# Altium project ControlBoard.PrjPCB
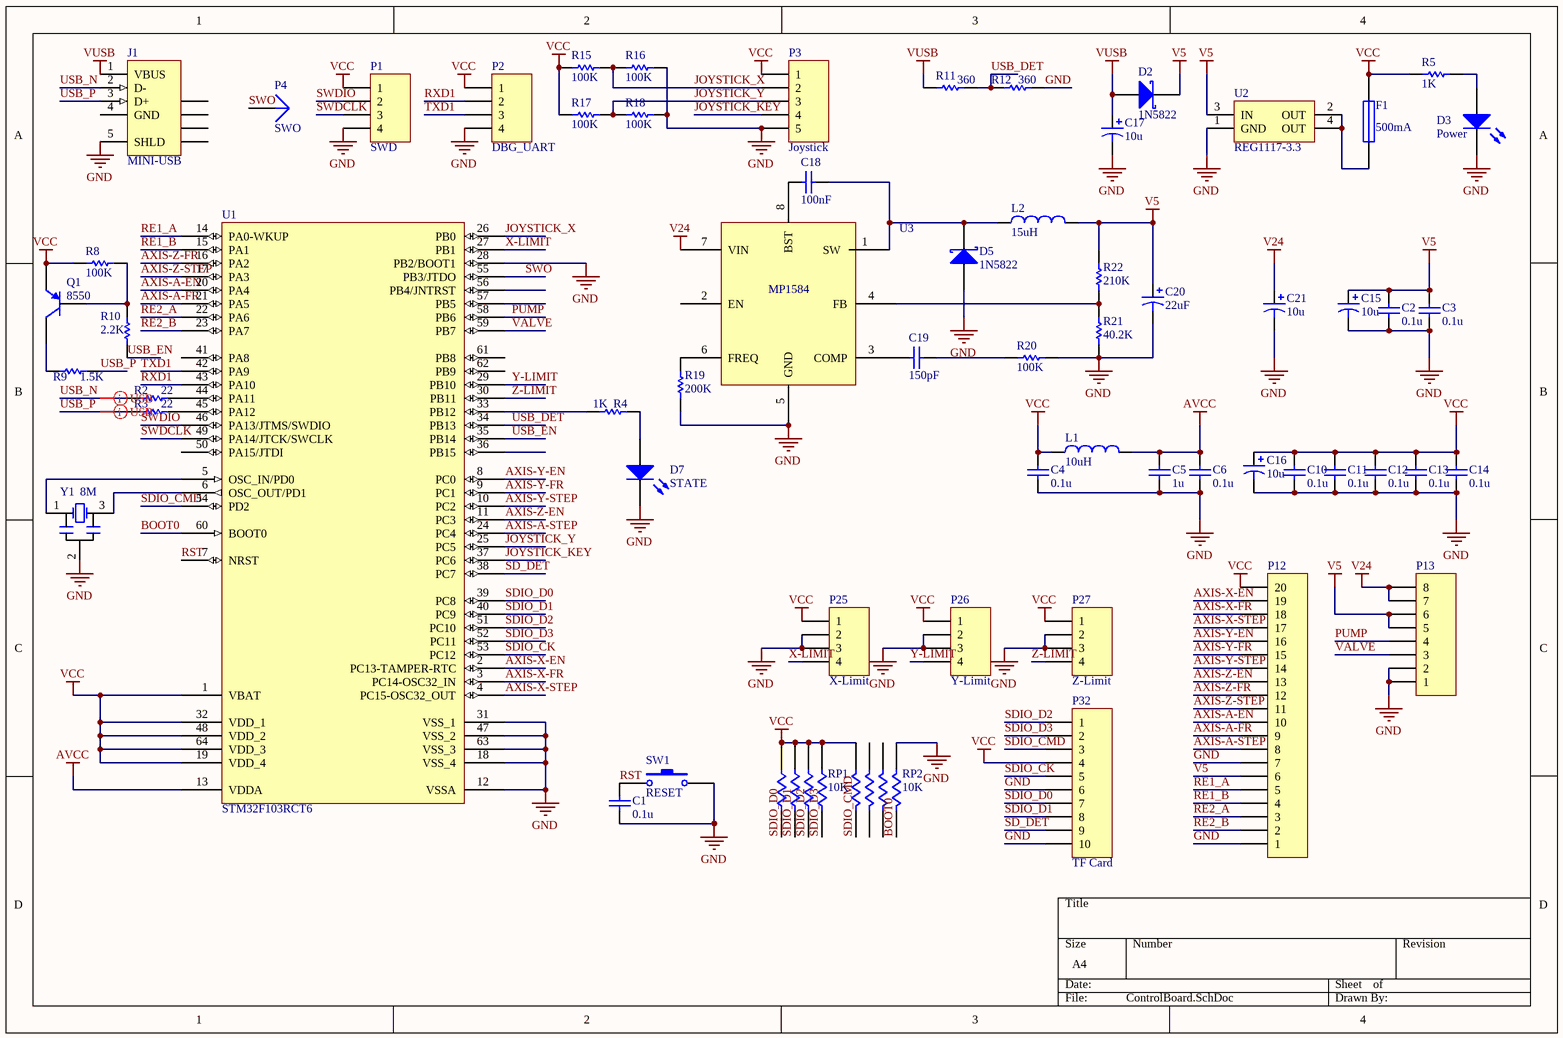
[diagram p0: ControlBoard.SchDoc]
1 sheet, 61 parts. Net scope: global (net labels, ports and power ports of the same name join across sheets).
Board file: ControlBoard.PcbDoc

## Sheet ControlBoard.SchDoc
size A4

### Parts
C1  value 0.1u  [C-1608[0603]]  (hidden comment: Cap Semi)
C2  value 0.1u  [C-1608[0603]]  (hidden comment: Cap Semi)
C3  value 0.1u  [C-1608[0603]]  (hidden comment: Cap Semi)
C4  value 0.1u  [C-1608[0603]]  (hidden comment: Cap Semi)
C5  value 1u  [C-1608[0603]]  (hidden comment: Cap Semi)
C6  value 0.1u  [C-1608[0603]]  (hidden comment: Cap Semi)
C10  value 0.1u  [C-1608[0603]]  (hidden comment: Cap Semi)
C11  value 0.1u  [C-1608[0603]]  (hidden comment: Cap Semi)
C12  value 0.1u  [C-1608[0603]]  (hidden comment: Cap Semi)
C13  value 0.1u  [C-1608[0603]]  (hidden comment: Cap Semi)
C14  value 0.1u  [C-1608[0603]]  (hidden comment: Cap Semi)
C15  value 10u  [C-2012[0805]]  (hidden comment: Cap Pol3)
C16  value 10u  [C-2012[0805]]  (hidden comment: Cap Pol3)
C17  value 10u  [C-2012[0805]]  (hidden comment: Cap Pol3)
C18  value 100nF  [C-1608[0603]]  (hidden comment: Cap Semi)
C19  value 150pF  [C-1608[0603]]  (hidden comment: Cap Semi)
C20  value 22uF  [C1206]  (hidden comment: Cap Pol3)
C21  value 10u  [C1206]  (hidden comment: Cap Pol3)
D2  1N5822  [DO-214AC]
D3  Power  [LED-0805]
D5  1N5822  [DO-214AC]
D7  STATE  [LED-0805]
F1  value 500mA  [2012[0805]]
J1  MINI-USB  [Mini USB 3D]
L1  value 10uH  [L0603]  (hidden comment: Inductor)
L2  value 15uH  [GDRH104R]  (hidden comment: Inductor)
P1  SWD  [HDR1X4]
P2  DBG_UART  [HDR1X4]
P3  Joystick  [HDR1X5]
P4  SWO  [HDR1X1]
P12  Header 20  [HDR1X20-3D]  (value not drawn)
P13  Header 8  [HDR1X8-3D]  (value not drawn)
P25  X-Limit  [HDR1X4]
P26  Y-Limit  [HDR1X4]
P27  Z-Limit  [HDR1X4]
P32  TF Card  [MicroSD auto]
Q1  8550  [SOT23B]
R2  value 22  [R-1608[0603]]  (hidden comment: Res Semi)
R3  value 22  [R-1608[0603]]  (hidden comment: Res Semi)
R4  value 1K  [R-1608[0603]]  (hidden comment: Res Semi)
R5  value 1K  [R-1608[0603]]  (hidden comment: Res Semi)
R8  value 100K  [R-1608[0603]]  (hidden comment: Res Semi)
R9  value 1.5K  [R-1608[0603]]  (hidden comment: Res Semi)
R10  value 2.2K  [R-1608[0603]]  (hidden comment: Res Semi)
R11  value 360  [R-1608[0603]]  (hidden comment: Res Semi)
R12  value 360  [R-1608[0603]]  (hidden comment: Res Semi)
R15  value 100K  [R-1608[0603]]  (hidden comment: Res Semi)
R16  value 100K  [R-1608[0603]]  (hidden comment: Res Semi)
R17  value 100K  [R-1608[0603]]  (hidden comment: Res Semi)
R18  value 100K  [R-1608[0603]]  (hidden comment: Res Semi)
R19  value 200K  [R-1608[0603]]  (hidden comment: Res Semi)
R20  value 100K  [R-1608[0603]]  (hidden comment: Res Semi)
R21  value 40.2K  [R-1608[0603]]  (hidden comment: Res Semi)
R22  value 210K  [R-1608[0603]]  (hidden comment: Res Semi)
RP1  10K  [R0603x4]
RP2  10K  [R0603x4]
SW1  RESET  [SW-3D]
U1  STM32F103RCT6  [LQFP64_N]
U2  REG1117-3.3  [SOT223-3D]
U3  MP1584  [MP1584]  (value not drawn)
Y1  8M  [Crystal_C]

### Nets
AVCC: C5.2 C6.2 L1.2 U1.13(VDDA)
GND: C1.1 C2.1 C3.1 C4.1 C5.1 C6.1 C10.1 C11.1 C12.1 C13.1 C14.1 C15.2 C16.2 C17.2 C20.2 C21.2 D3.2(K) D5.1(A) D7.2(K) J1.5(SHLD) P1.4 P2.4 P3.5 P12.1 P12.7 P13.1 P13.2 P25.2 P25.3 P26.2 P26.3 P27.2 P27.3 P32.6 P32.10 R12.1 R16.1 R18.1 R19.1 R20.1 R21.2 RP2.4 SW1.2 U1.12(VSSA) U1.18(VSS_4) U1.28(PB2/BOOT1) U1.31(VSS_1) U1.47(VSS_2) U1.63(VSS_3) U2.1(GND) U3.5(GND) Y1.2(GND)
V5: C2.2 C3.2 C15.1 C20.1 D2.2(K) L2.2 P12.6 P13.5 P13.6 R22.1 U2.3(IN)
V24: C21.1 P13.7 P13.8 U3.7(VIN)
VCC: C4.2 C10.2 C11.2 C12.2 C13.2 C14.2 C16.1 F1.2 L1.1 P1.1 P2.1 P3.1 P12.20 P25.1 P26.1 P27.1 P32.4 Q1.3(E) R5.2 R8.2 R15.2 R17.2 RP1.5 RP1.6 RP1.7 RP1.8 RP2.1 U1.1(VBAT) U1.19(VDD_4) U1.32(VDD_1) U1.48(VDD_2) U1.64(VDD_3)
VUSB: C17.1 D2.1(A) J1.1(VBUS) R11.2
AXIS-A-EN: P12.10 U1.20(PA4)
AXIS-A-FR: P12.9 U1.21(PA5)
AXIS-A-STEP: P12.8 U1.24(PC4)
AXIS-X-EN: P12.19 U1.2(PC13-TAMPER-RTC)
AXIS-X-FR: P12.18 U1.3(PC14-OSC32_IN)
AXIS-X-STEP: P12.17 U1.4(PC15-OSC32_OUT)
AXIS-Y-EN: P12.16 U1.8(PC0)
AXIS-Y-FR: P12.15 U1.9(PC1)
AXIS-Y-STEP: P12.14 U1.10(PC2)
AXIS-Z-EN: P12.13 U1.11(PC3)
AXIS-Z-FR: P12.12 U1.16(PA2)
AXIS-Z-STEP: P12.11 U1.17(PA3)
BOOT0: RP2.5 U1.60(BOOT0)
JOYSTICK_KEY: P3.4 U1.37(PC6)
JOYSTICK_X: P3.2 R15.1 R16.2 U1.26(PB0)
JOYSTICK_Y: P3.3 R17.1 R18.2 U1.25(PC5)
PUMP: P13.4 U1.58(PB6)
RE1_A: P12.5 U1.14(PA0-WKUP)
RE1_B: P12.4 U1.15(PA1)
RE2_A: P12.3 U1.22(PA6)
RE2_B: P12.2 U1.23(PA7)
RST: C1.2 SW1.1 U1.7(NRST)
RXD1: P2.2 U1.43(PA10)
SD_DET: P32.9 U1.38(PC7)
SDIO_CK: P32.5 U1.53(PC12)
SDIO_CMD: P32.3 RP2.8 U1.54(PD2)
SDIO_D0: P32.7 RP1.1 U1.39(PC8)
SDIO_D1: P32.8 RP1.2 U1.40(PC9)
SDIO_D2: P32.1 RP1.3 U1.51(PC10)
SDIO_D3: P32.2 RP1.4 U1.52(PC11)
SWDCLK: P1.3 U1.49(PA14/JTCK/SWCLK)
SWDIO: P1.2 U1.46(PA13/JTMS/SWDIO)
SWO: P4.1 U1.55(PB3/JTDO)
TXD1: P2.3 U1.42(PA9)
USB_DET: R11.1 R12.2 U1.34(PB13)
USB_EN: R10.1 U1.35(PB14)
USB_N: J1.2(D-) R2.1
USB_P: J1.3(D+) R3.1 R9.1
VALVE: P13.3 U1.59(PB7)
X-LIMIT: P25.4 U1.27(PB1)
Y-LIMIT: P26.4 U1.29(PB10)
Z-LIMIT: P27.4 U1.30(PB11)
NetC18_1: C18.1 D5.2(K) L2.1 U3.1(SW)
NetC18_2: C18.2 U3.8(BST)
NetC19_1: C19.1 R20.2
NetC19_2: C19.2 U3.3(COMP)
NetD3_1: D3.1(A) R5.1
NetD7_1: D7.1(A) R4.2
NetF1_1: F1.1 U2.2(OUT) U2.4(OUT)
NetQ1_1: Q1.1(C) R9.2
NetQ1_2: Q1.2(B) R8.1 R10.2
NetR2_2: R2.2 U1.44(PA11)
NetR3_2: R3.2 U1.45(PA12)
NetR4_1: R4.1 U1.33(PB12)
NetR19_2: R19.2 U3.6(FREQ)
NetR21_1: R21.1 R22.2 U3.4(FB)
NetU1_5: U1.5(OSC_IN/PD0) Y1.1(OSC1)
NetU1_6: U1.6(OSC_OUT/PD1) Y1.3(OSC2)

Not connected (* = marked no-connect by the designer): J1 4(GND) 6(SHLD) 7(SHLD) 8(SHLD) 9(SHLD); RP2 2 3 6 7; U1 36(PB15) 41(PA8) 50(PA15/JTDI) 56(PB4/JNTRST) 57(PB5) 61(PB8) 62(PB9); U3 2(EN)

### Layout directives
differential pair: USB_N, USB_P

### Library data of the parts
C1-C6 C10-C14 C18 C19 = Cap Semi: Capacitor (Semiconductor SIM Model); Published: 8-Jun-2000; LatestRevisionDate: 17-Jul-2002; LatestRevisionNote: Re-released for DXP Platform.; PackageReference: C1206; Publisher: Altium Limited
C15-C17 C20 C21 = Cap Pol3: Polarized Capacitor (Surface Mount); Published: 8-Jun-2000; LatestRevisionDate: 17-Jul-2002; LatestRevisionNote: Re-released for DXP Platform.; PackageReference: C0805; Publisher: Altium Limited
D2 D5 = D Schottky: Schottky Diode; Published: 8-Jun-2000; LatestRevisionDate: 17-Jul-2002; LatestRevisionNote: Re-released for DXP Platform.; PackageReference: SMB; Publisher: Altium Limited; Code_JEDEC: DO-214-AA
D3 D7 = LED2: Typical RED, GREEN, YELLOW, AMBER GaAs LED; Published: 8-Jun-2000; LatestRevisionDate: 17-Jul-2002; LatestRevisionNote: Re-released for DXP Platform.; PackageDocument: Feb-2002; PackageReference: 3.2X1.6X1.1; Publisher: Altium Limited
F1 = Fuse 1: Fuse; Published: 8-Jun-2000; LatestRevisionDate: 17-Jul-2002; LatestRevisionNote: Re-released for DXP Platform.; PackageReference: PIN-W2/E2.8; Publisher: Altium Limited
J1 = 440478-1: USB 2.0, Right Angle, SMT, A Type, Receptacle, 5 Position, Black; ContactMaterial: Phosphor Bronze; ContactPlating: Gold (30) over Nickel; PCB_Layout: Complies with manufacturer's recommendation.; DrillSize: Corresponds to nominal value.; PanelGround: Without; Published: 15-Jul-2004; DatasheetDocument: 15-Nov-2002; PackageDocument: 15-Nov-2002; PackageReference: 440478; Publisher: Altium Limited; HousingMaterial: Thermoplastic; ComponentLink1Description: Manufacturer Link; ComponentLink1URL: http://www.tycoelectronics.com/; ComponentLink2Description: Packaging Specification; ComponentLink2URL: http://ecommas.tycoelectronics.com/commerce/DocumentDelivery/DDEController?Action=showdoc&DocId=Customer+Drawing%7F440478%7FB%7Fpdf%7FEnglish%7FC_440478_B.pdf
L1 L2 = Inductor: Code_IEC: 1005; Published: 8-Jun-2000; LatestRevisionDate: 17-Jul-2002; LatestRevisionNote: Re-released for DXP Platform.; PackageReference: 0402-A; Publisher: Altium Limited; Code_JEITA: 0402
P1 P2 P25-P27 = Header 4: Header, 4-Pin; LatestRevisionDate: 17-Jul-2002; LatestRevisionNote: Re-released for DXP Platform.; Publisher: Altium Limited
P3 = Header 5: Header, 5-Pin; LatestRevisionDate: 17-Jul-2002; LatestRevisionNote: Re-released for DXP Platform.; Publisher: Altium Limited
P4 = Plug: LatestRevisionDate: 17-Jul-2002; LatestRevisionNote: Re-released for DXP Platform.; Publisher: Altium Limited
P12 = Header 20: Header, 20-Pin; LatestRevisionDate: 17-Jul-2002; LatestRevisionNote: Re-released for DXP Platform.; Publisher: Altium Limited
P13 = Header 8: Header, 8-Pin; LatestRevisionDate: 17-Jul-2002; LatestRevisionNote: Re-released for DXP Platform.; Publisher: Altium Limited
P32 = Header 10: Header, 10-Pin; LatestRevisionDate: 17-Jul-2002; LatestRevisionNote: Re-released for DXP Platform.; Publisher: Altium Limited
Q1 = PNP: PNP Bipolar Transistor; pin to pad: 1>3 2>1 3>2; Published: 8-Jun-2000; LatestRevisionDate: 17-Jul-2002; LatestRevisionNote: Re-released for DXP Platform.; PackageReference: SOT-23B; Publisher: Altium Limited; Code_JEDEC: SOT-23
R2-R5 R8-R12 R15-R22 = Res Semi: Semiconductor Resistor; Published: 8-Jun-2000; LatestRevisionDate: 17-Jul-2002; LatestRevisionNote: Re-released for DXP Platform.; PackageReference: AXIAL-0.5; Publisher: Altium Limited
RP1 RP2 = RPACK4
SW1 = SW-PB: Switch; Published: 24-Mar-1999; LatestRevisionDate: 17-Jul-2002; LatestRevisionNote: Re-released for DXP Platform.; PackageReference: SPST-2; Publisher: Altium Limited
U1 = STM32F103RBT6: STM32 ARM-based 32-bit MCU High-density; Published: 30-May-2008; DatasheetVersion: rev6, Mar-2008; PackageVersion: Mar-2008; PackageReference: LQFP64; Publisher: Altium Limited; PackageDescription: 64-Pin Low-Profile Quad Flat Pack, 10 x 10 mm Body, 0.5 mm Pitch (LQFP64); ComponentLink1Description: Manufacturer Link; ComponentLink1URL: www.st.com/stm32; ComponentLink2Description: Datasheet; ComponentLink2URL: http://www.st.com/stonline/products/literature/ds/13587.pdf
U2 = REG1117-3.3: 800mA and 1A Low Dropout Positive Regulator 2.85V, 3.3V, 5V, and Adjustable; Published: 8-Jun-2000; LatestRevisionDate: 17-Jul-2002; LatestRevisionNote: Re-released for DXP Platform.; DatasheetVersion: Sep-1997; PackageVersion: revC; PackageReference: ZZ311; Publisher: Altium Limited; PackageDescription: SOT-223/SC-73; 4 Leads; Body 6.7 x 7.3 mm, inc. leads (LxW max); ComponentLink1Description: Manufacturer Link; ComponentLink1URL: http://www.ti.com/; ComponentLink2Description: Datasheet; ComponentLink2URL: http://www-s.ti.com/sc/ds/REG1117.pdf
Y1 = XTAL_C: Crystal Oscillator; Published: 8-Jun-2000; LatestRevisionDate: 17-Jul-2002; LatestRevisionNote: Re-released for DXP Platform.; PackageReference: R38; Publisher: Altium Limited